# EAGLE design fulladderripplerelay_version2 (EAGLE 9.6.2)
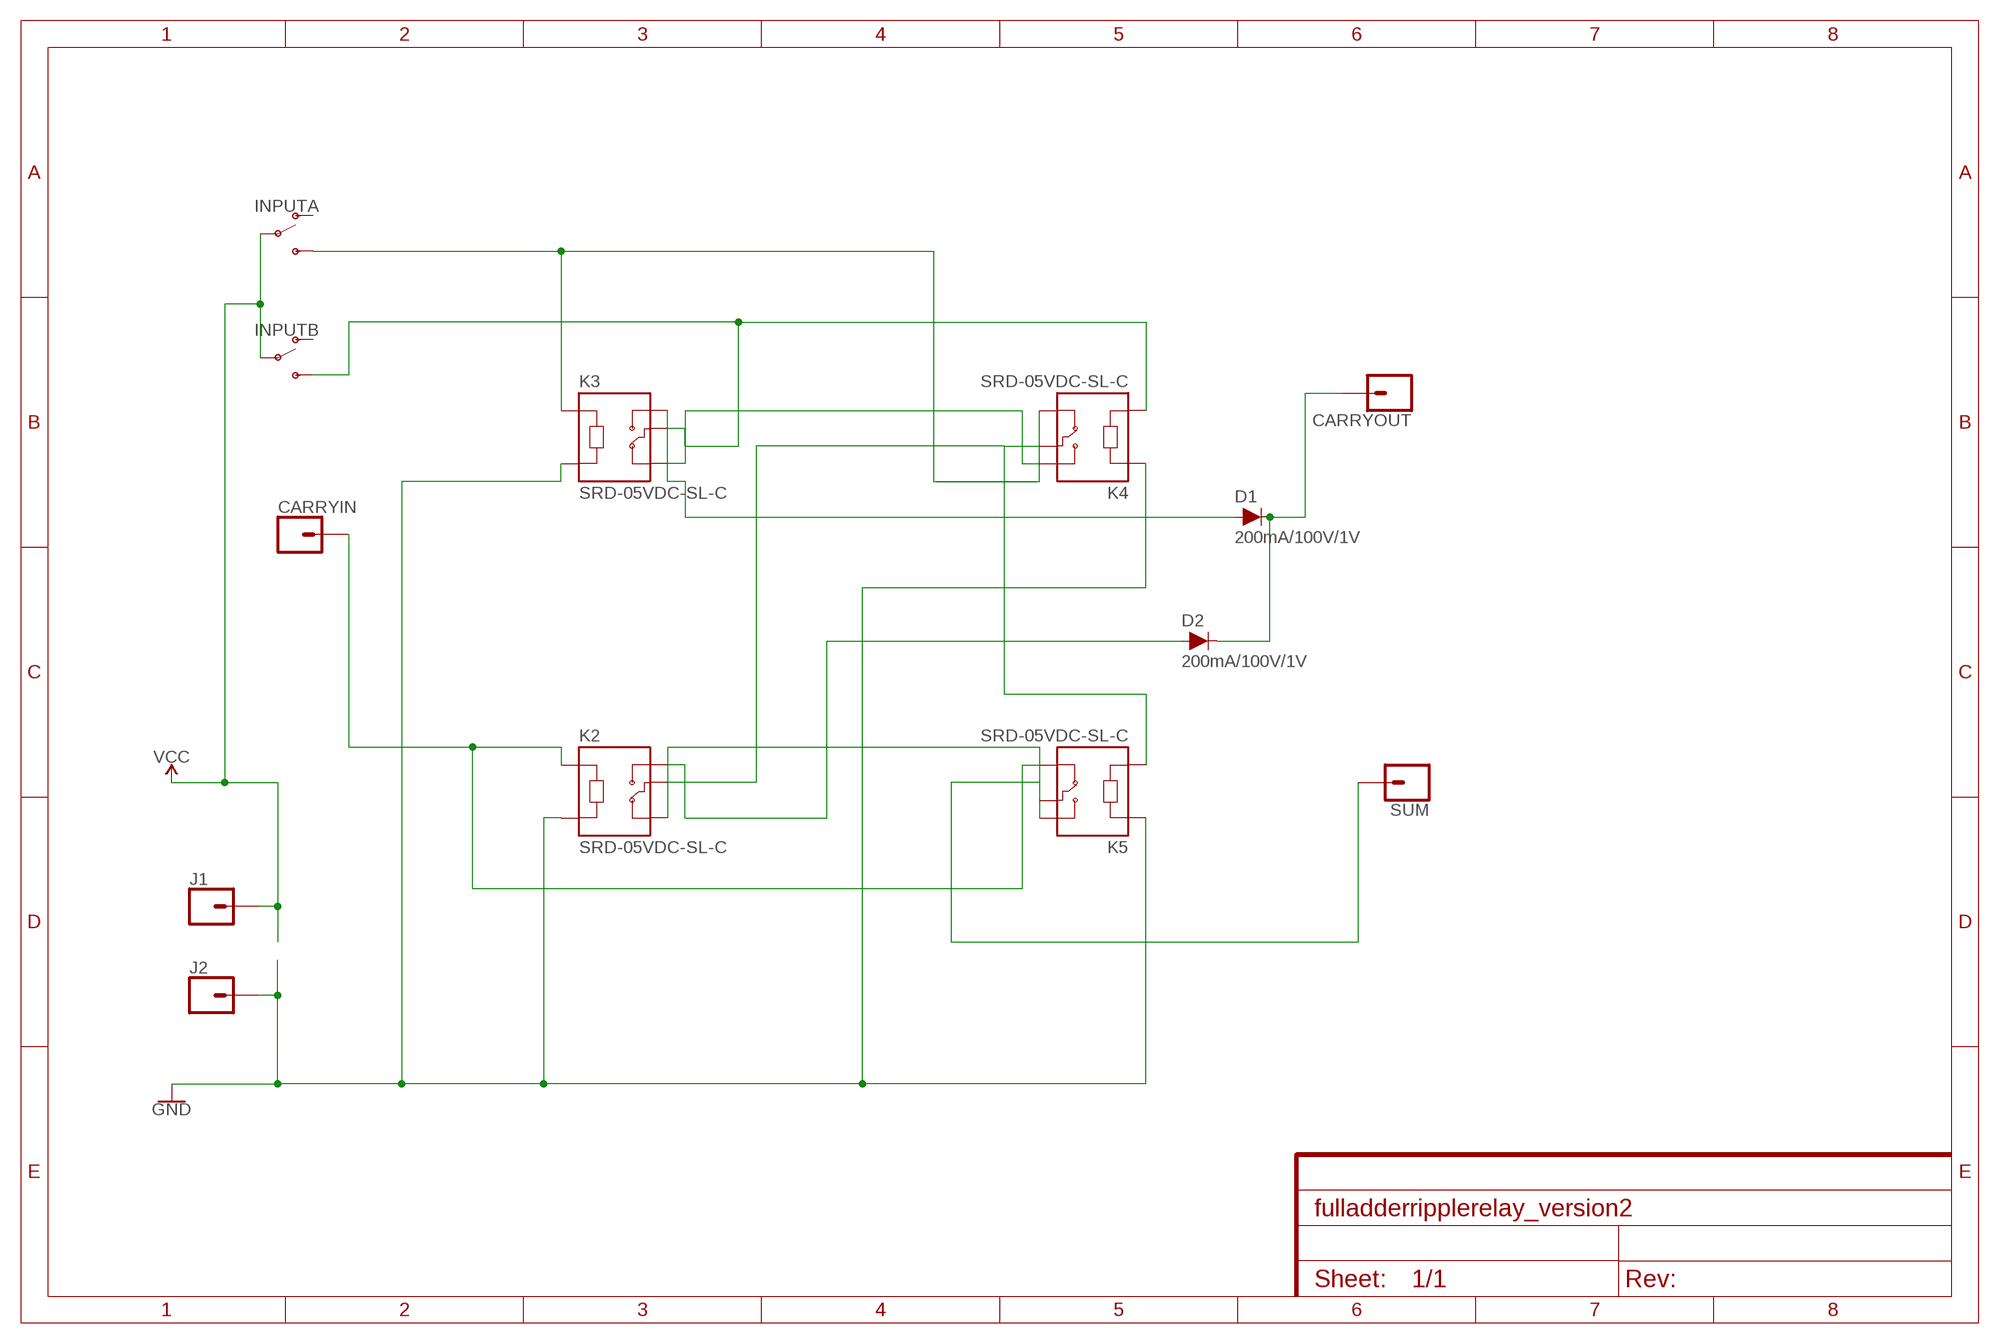
[diagram p0: schematic, sheet 1]

## Parts
CARRYIN  CONN_01PTH_LONGPAD  [1X01_LONGPAD]
CARRYOUT  CONN_01PTH_LONGPAD  [1X01_LONGPAD]
D1  200mA/100V/1V  DIODE-1N4148  [DIODE-1N4148]
D2  200mA/100V/1V  DIODE-1N4148  [DIODE-1N4148]
INPUTA  SWITCH-SPDT-PTH-11.6X4.0MM  [SWITCH_SPDT_PTH_11.6X4.0MM]
INPUTB  SWITCH-SPDT-PTH-11.6X4.0MM  [SWITCH_SPDT_PTH_11.6X4.0MM]
J1  CONN_01PTH_LONGPAD  [1X01_LONGPAD]
J2  CONN_01PTH_LONGPAD  [1X01_LONGPAD]
K2  SRD-05VDC-SL-C  [RELAY_SRD-05VDC-SL-C]
K3  SRD-05VDC-SL-C  [RELAY_SRD-05VDC-SL-C]
K4  SRD-05VDC-SL-C  [RELAY_SRD-05VDC-SL-C]
K5  SRD-05VDC-SL-C  [RELAY_SRD-05VDC-SL-C]
SUM  CONN_01PTH_LONGPAD  [1X01_LONGPAD]

## Nets
GND: J2.1 K2.A2 K3.A2 K4.A1 K5.A1
N$1: INPUTA.3(S) K3.A1 K4.NC
N$2: K3.NC K4.NO
N$3: D1.A K3.NO
N$4: CARRYOUT.1 D1.C D2.C
N$5: INPUTB.3(S) K3.COM K4.A2
N$6: K2.COM K4.COM K5.A2
N$7: K2.NC K5.NO
N$8: D2.A K2.NO
N$9: K5.COM SUM.1
N$10: CARRYIN.1 K2.A1 K5.NC
VCC: INPUTA.2(P) INPUTB.2(P) J1.1
Unconnected: INPUTA.1(O) INPUTB.1(O)

## Library data of the parts
CARRYIN CARRYOUT J1 J2 SUM = SparkFun-Connectors:CONN_01: Single connection point. Often used as Generic Header-pin footprint for 0.1 inch spaced/style header connections On any of the 0.1 inch spaced packages, you can populate with these: Break Away Headers - Straight <https://www.sparkfun.com/products/116> (PRT-00116) Break Away Male Headers - Right Angle <https://www.sparkfun.com/products/553> (PRT-00553) Female Headers <https://www.sparkfun.com/products/115> (PRT-00115) Break Away Headers - Machine Pin <https://www.sparkfun.com/products/117> (PRT-00117) Break Away Female Headers - Swiss Machine Pin <https://www.sparkfun.com/products/743> (PRT-00743) This device is also useful as a general connection point to wire up your design to another part of your project. Our various solder wires solder well into these plated through hole pads. Hook-Up Wire - Assortment (Stranded, 22 AWG) <https://www.sparkfun.com/products/11375> (PRT-11375) Hook-Up Wire - Assortment (Solid Core, 22 AWG) <https://www.sparkfun.com/products/11367> (PRT-11367) View the entire wire category on our website here <https://www.sparkfun.com/categories/141> Special notes: SMTSO-256-ET is a "flush mount" nut for a 4-40 screw. We mostly use this on specialty testbeds; it is a nice way to connect hardware to your PCB at an adjustable hieght. Also note, the SNAP packages are for using a snappable style connector. We sell a baggie of snaps and they are also used on two LilyPad designs: Snap Assortment - 30 pack (male and female) <https://www.sparkfun.com/products/11347> (DEV-11347) LilyPad Arduino SimpleSnap <https://www.sparkfun.com/products/10941> (DEV-10941) LilyPad SimpleSnap Protoboard <https://www.sparkfun.com/products/10940> (DEV-10940)
D1 D2 = SparkFun-DiscreteSemi:DIODE: Diode These are standard reverse protection diodes and small signal diodes. SparkFun Products: SparkFun SparkPunk Sound Kit <https://www.sparkfun.com/products/11177> SparkFun ESP8266 Thing <https://www.sparkfun.com/products/13231>; PROD_ID: DIO-08378
INPUTA INPUTB = SparkFun-Switches:SWITCH-SPDT: Single Pole, Double Throw (SPDT) Switch Single-pole, double-throw (SPDT) switch. Variant Overview SMD-AYZ0202 Surface Mount DPDT Switch <https://www.sparkfun.com/products/597> (COM-00597) Used on e.g. LilyPad Arduino USB - ATmega32U4 Board <https://www.sparkfun.com/products/12049> PTH-11.6X4.0MM SPDT Mini Power Switch <https://www.sparkfun.com/products/102> (COM-00102) Used on e.g. SparkFun Simon Says - Through-Hole Soldering Kit <https://www.sparkfun.com/products/10547> (KIT-10547) PTH-11.6X4.0MM-KIT KIT version of SPDT Mini Power Switch - Simplifies soldering by removing tStop of switch pins - only one side can be soldered. PTH-11.6X4.0MM-LOCK LOCK version of SPDT Mini Power Switch - Offset pins hold switch in place for easier soldering. SMD-RIGHT-ANGLE Surface Mount Right Angle Switch <https://www.sparkfun.com/products/10860> (COM-10860) Used on e.g. SparkFun ESP8266 Thing <https://www.sparkfun.com/products/13231>; PROD_ID: SWCH-08261; SF_SKU: COM-00102
K2-K5 = SRD-05VDC-SL-C (1):SRD-05VDC-SL-C: 5V Trigger Relay Module For Arduino And Raspberry Pi 5V Trigger Relay Module For Arduino And Raspberry Pi Check availability <https://pricing.snapeda.com/parts/SRD-05VDC-SL-C/Songle%20Relay/view-part?ref=eda>; AVAILABILITY: Not in stock; CHECK_PRICES: https://www.snapeda.com/parts/SRD-05VDC-SL-C/Songle+Relay/view-part/?ref=eda; DESCRIPTION: 5V Trigger Relay Module For Arduino And Raspberry Pi 5V Trigger Relay Module For Arduino And Raspberry Pi; MF: Songle Relay; MP: SRD-05VDC-SL-C; PACKAGE: NON STANDARD-5 Songle Relay; PRICE: None; SNAPEDA_LINK: https://www.snapeda.com/parts/SRD-05VDC-SL-C/Songle+Relay/view-part/?ref=snap

## Board
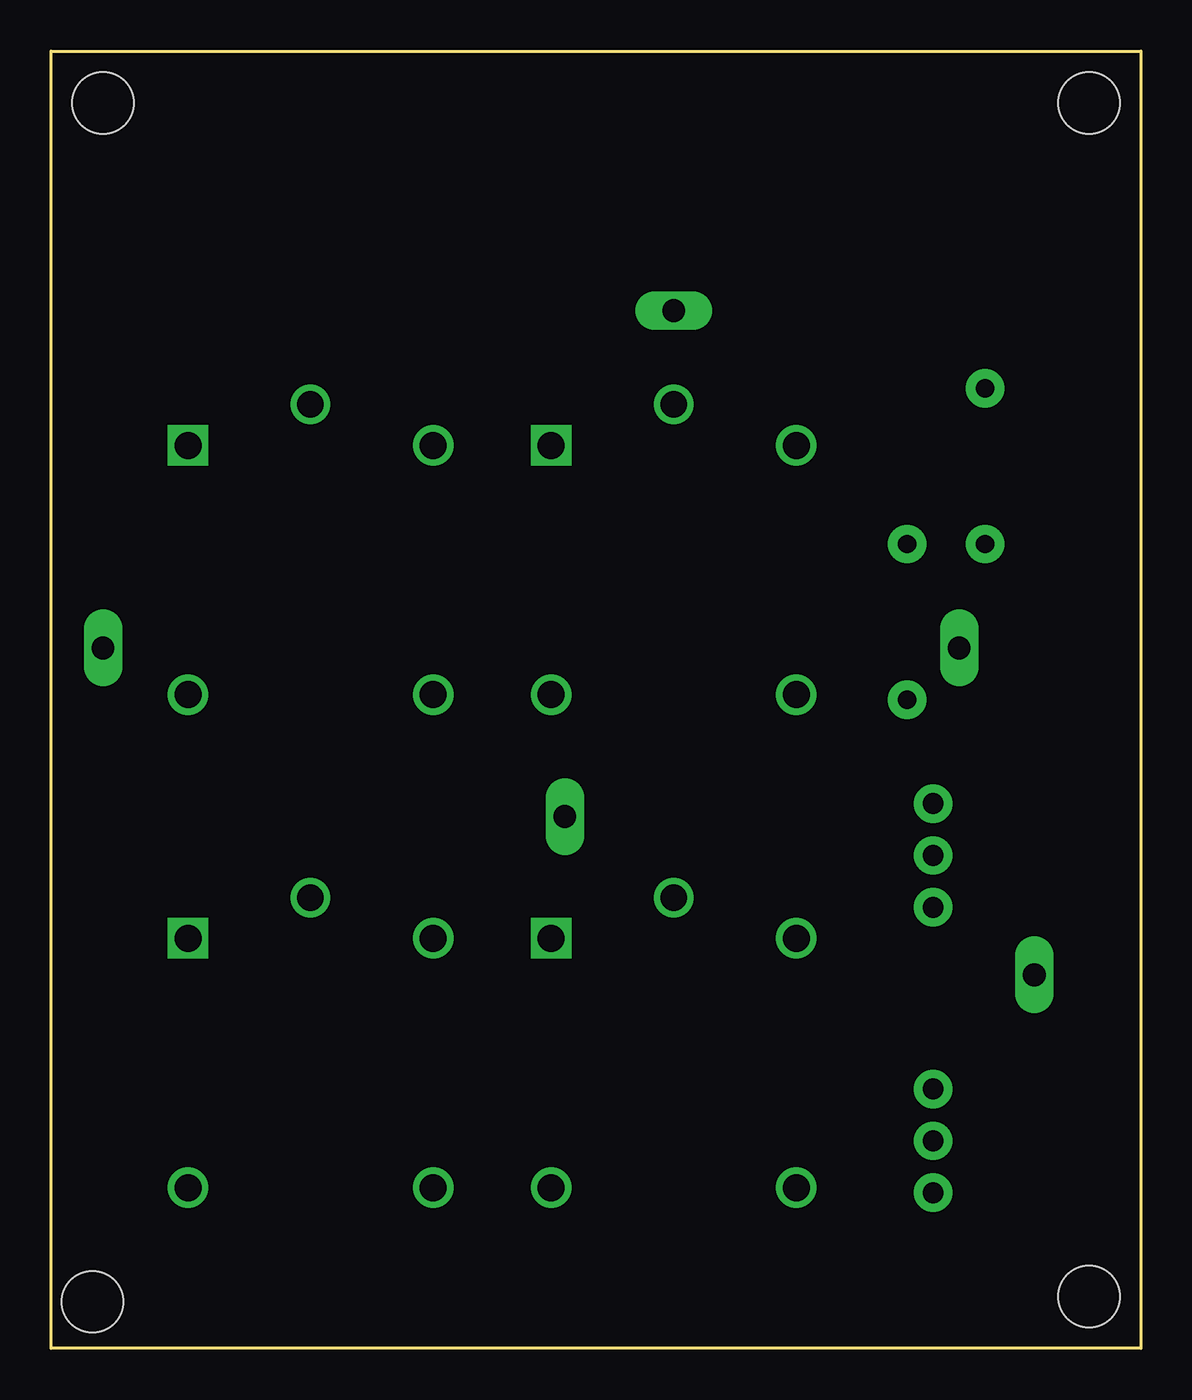
[diagram p1: board, top side]
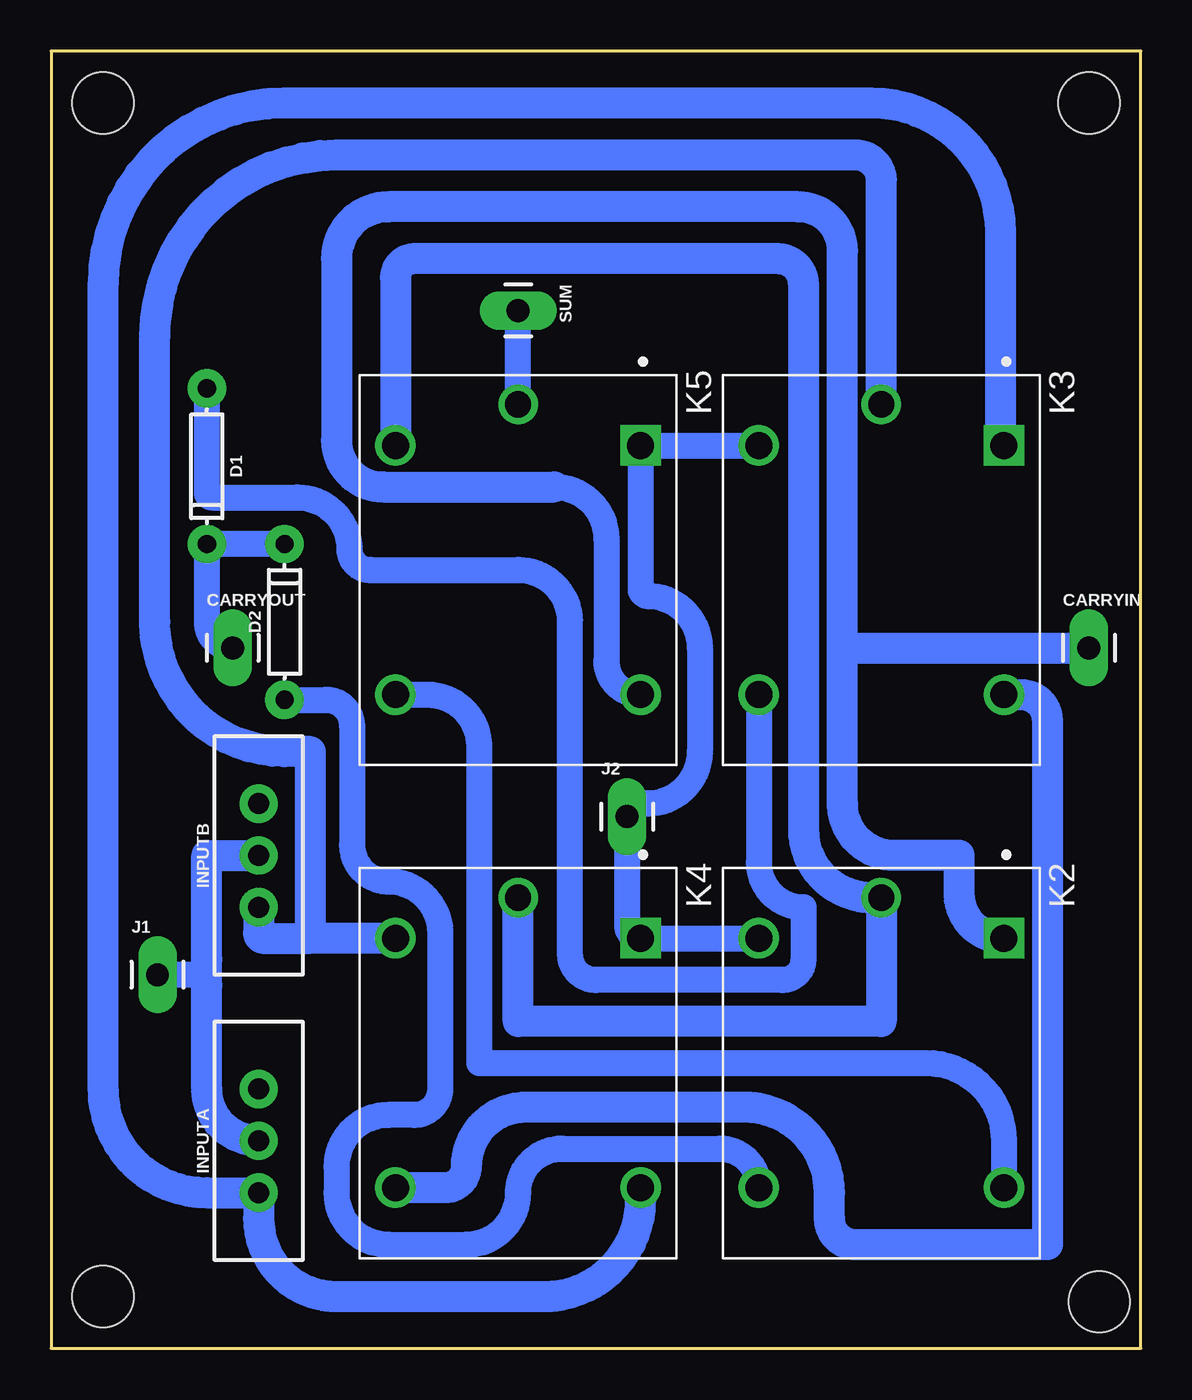
[diagram p2: board, bottom side, seen from below]

Size 53.34 x 63.5 mm. Coordinates in mm from the lower left corner, seen from the top.
Outline: 0,63.5 53.34,63.5 53.34,0 0,0 0,63.5
Copper layers (1*16): Top 0.035mm / dielectric 1.5mm / Bottom 0.035mm
Design rules "default": minimum track width 6mil, minimum drill 0.35mm, track to track 6mil, track to pad 6mil, pad to pad 6mil, via to via 6mil, smd to smd 6mil, copper to edge 40mil, drill to drill 6mil, minimum pad ring 10mil, minimum via ring 8mil, stop-mask expansion 4mil, vias tented up to drill 0mil, thermal gap 10mil
Holes 3 mm at 2.54,60.96 50.8,60.96 50.8,2.54 2.03,2.29

### Footprints (pad centres in the part's own frame; a part is rotated, then mirrored left to right if it is on the bottom)
1X01_LONGPAD = drill 1.118 pad 1.88 long: 1 0,0
DIODE-1N4148 = drill 0.9 pad 1.88: A -3.81,0; C 3.81,0
SWITCH_SPDT_PTH_11.6X4.0MM = drill 1.016 pad 1.88: 1 0,2.54; 2 0,0; 3 0,-2.54
RELAY_SRD-05VDC-SL-C = drill 1.32 square: A1 -6.1,6 | drill 1.32: A2 -6.1,-6; NC 6.1,6; NO 6.1,-6 | drill 1.29: COM -8.1,0

### Placement (x,y rotation side)
CARRYIN  2.54,34.29 0 bottom
CARRYOUT  44.45,34.29 0 bottom
D1  45.72,43.18 270 bottom
D2  41.91,35.56 90 bottom
INPUTA  43.18,10.16 0 bottom
INPUTB  43.18,24.13 0 bottom
J1  48.13,18.29 0 bottom
J2  25.15,26.04 0 bottom
K2  12.7,13.97 270 bottom
K3  12.7,38.1 270 bottom
K4  30.48,13.97 270 bottom
K5  30.48,38.1 270 bottom
SUM  30.48,50.8 270 bottom

### Tracks (layer width: path | path; a pad name or v marks a point on that pad's centre or on a via)
GND
  Bottom 1.27: K3.A2 K5.A1 24.48,37.18 arc-90 24.13,36.83 arc90 21.59,34.29 21.59,29.21 arc90 24.13,26.67 25.4,26.67 25.4,26.29 arc-90 J2.1 25.15,20.74 arc-90 K4.A1 K2.A2
N$1
  Bottom 1.524: K4.NC 24.48,7.27 arc90 29.21,2.54 39.37,2.54 arc90 43.18,6.35 INPUTA.3 45.72,7.62 arc90 50.8,12.7 50.8,52.07 arc90 41.91,60.96 13.21,60.96 arc90 6.86,54.61 6.86,44.2 K3.A1
N$2
  Bottom 1.524: K3.NC 5.84,32 arc90 4.57,30.73 4.57,5.08 13.97,5.08 arc90 15.24,6.35 15.24,7.62 arc-90 19.43,11.81 30.1,11.81 arc-90 33.02,8.89 arc90 34.04,7.87 K4.NO
N$3
  Bottom 1.27: K3.NO 18.7,23.78 arc-90 16.51,21.59 16.51,19.05 arc90 17.53,18.03 26.67,18.03 arc90 27.94,19.3 27.94,35.56 arc-90 30.48,38.1 37.72,38.1 arc90 38.73,39.12 arc-90 41.27,41.66 45.47,41.66 arc90 45.72,41.91 D1.A
N$4
  Bottom 1.27: D2.C D1.C 45.72,35.56 arc-90 CARRYOUT.1
N$5
  Bottom 1.524: INPUTB.3 43.18,20.32 arc-90 42.93,20.07 40.64,20.07 | K4.A2 40.64,20.07 | 40.64,20.07 40.64,29.21 41.91,29.21 arc90 48.26,35.56 48.26,49.53 arc90 39.37,58.42 13.97,58.42 arc90 12.7,57.15 K3.COM
N$6
  Bottom 1.524: K4.COM 30.48,16 12.7,16 K2.COM 13.18,22.07 arc90 16.51,25.4 16.51,52.07 arc-90 17.78,53.34 35.56,53.34 arc-90 36.48,52.42 K5.A2
N$7
  Bottom 1.27: K5.NO 34.92,32 arc90 32.38,29.46 32.38,13.97 10.51,13.97 arc90 6.7,10.16 K2.NC
N$8
  Bottom 1.27: D2.A 39.88,31.75 arc90 38.61,30.48 38.61,24.64 arc-90 36.83,22.86 arc90 34.29,20.32 34.29,12.7 arc90 35.56,11.43 36.83,11.43 arc-90 39.37,8.89 39.37,7.62 arc-90 36.83,5.08 33.02,5.08 arc-90 30.48,7.62 arc90 28.32,9.78 20.61,9.78 arc90 K2.NO
N$9
  Bottom 1.27: K5.COM SUM.1
N$10
  Bottom 1.27: 28.7,42.16 arc90 26.16,39.62 26.16,33.66 arc-90 24.51,32 K5.NC
  Bottom 1.524: K2.A1 arc90 8.89,22.26 8.89,24.13 12.06,24.13 arc90 14.61,26.67 14.61,34.29 | 14.61,34.29 14.61,53.72 arc-90 16.76,55.88 36.83,55.88 arc-90 39.37,53.34 39.37,44.45 arc-90 37.08,42.16 28.7,42.16 | 14.61,34.29 CARRYIN.1
VCC
  Bottom 1.27: 46.23,18.29 arc90 45.72,17.78 | 45.72,19.05 arc90 46.48,18.29 J1.1
  Bottom 1.524: INPUTA.2 arc90 45.72,12.7 45.72,17.78 45.72,19.05 45.72,24.13 INPUTB.2